# EAGLE design KD Board (EAGLE 9.0.0)
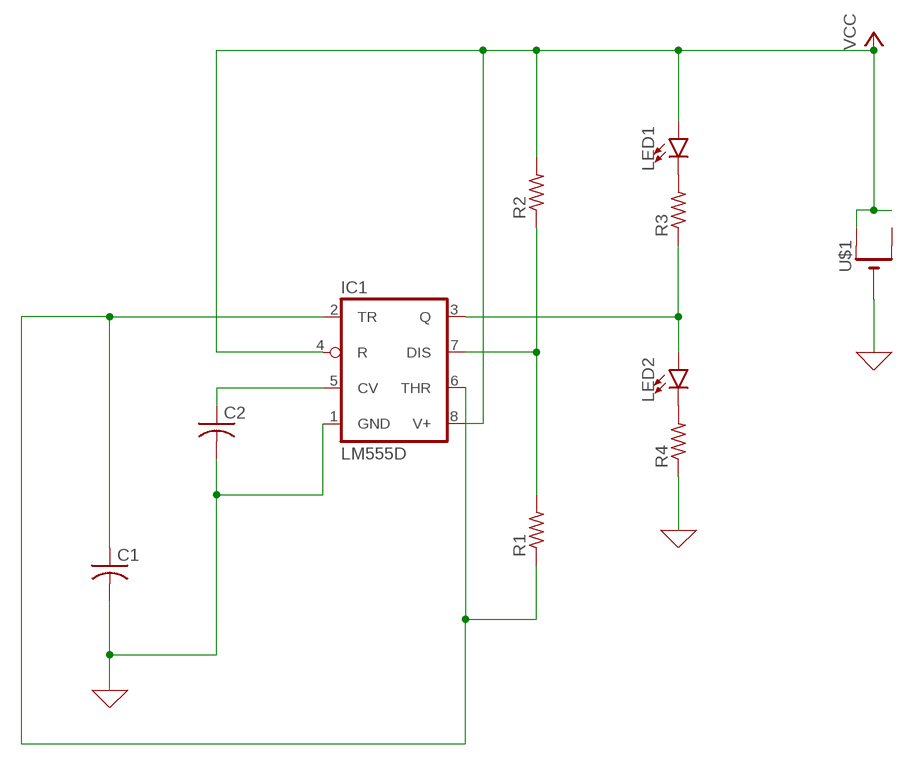
[diagram p0: schematic, sheet 1]

## Parts
C1  C-USC0805K  [C0805K]
C2  C-USC0805K  [C0805K]
IC1  LM555D  [SO08]
LED1  LED  [LED_5MM]
LED2  LED  [LED_5MM]
R1  R-US_M0805  [M0805]
R2  R-US_M0805  [M0805]
R3  R-US_M0805  [M0805]
R4  R-US_M0805  [M0805]
U$1  CR1220THM  [CR1220-THM]

## Nets
0: C1.2 C2.2 IC1.1(GND) R4.1 U$1.- ; supply symbol labelled GND
N$1: C2.1 IC1.5(CV)
N$2: C1.1 IC1.2(TR) IC1.6(THR) R1.1
N$4: IC1.7(DIS) R1.2 R2.1
N$6: LED1.K(C) R3.2
N$7: LED2.K(C) R4.2
N$8: IC1.3(Q) LED2.A R3.1
VCC: IC1.4(R) IC1.8(V+) LED1.A R2.2 U$1.+1(+)
Unconnected: U$1.+2(+1)

## Library data of the parts
C1 C2 = resistor:C-US: CAPACITOR, American symbol
IC1 = linear:*555: TIMER
LED1 LED2 = League_555_Blinky:LED
R1-R4 = resistor:R-US_: RESISTOR, American symbol
U$1 = League_555_Blinky:CR1220: CR1216/CR1220/CR1225 12mm 3V lithium coin cell Great for battery packup. Both SMT and THM holders. Note the THM package has the ground pads on both sides of the PCB so that the masks are the same - this reduces the cost

## Board
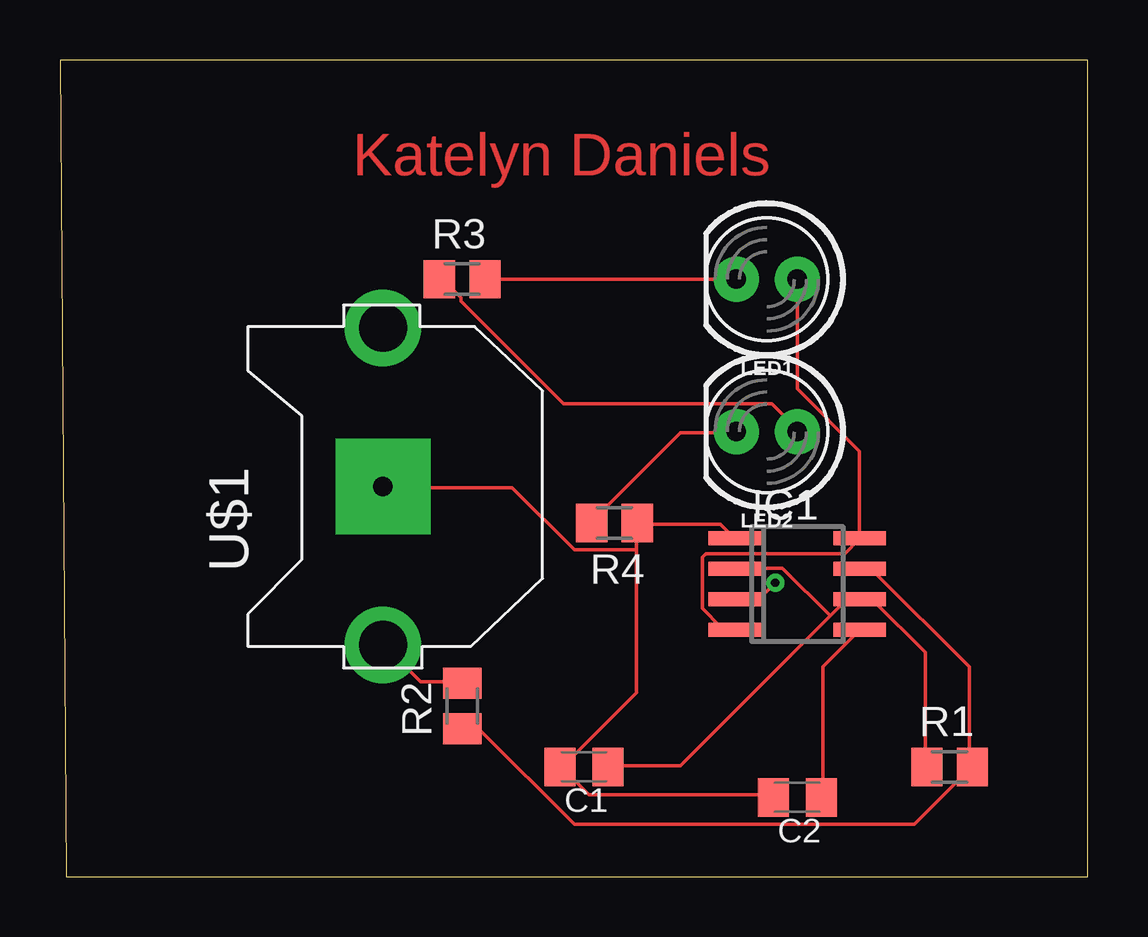
[diagram p1: board, top side]
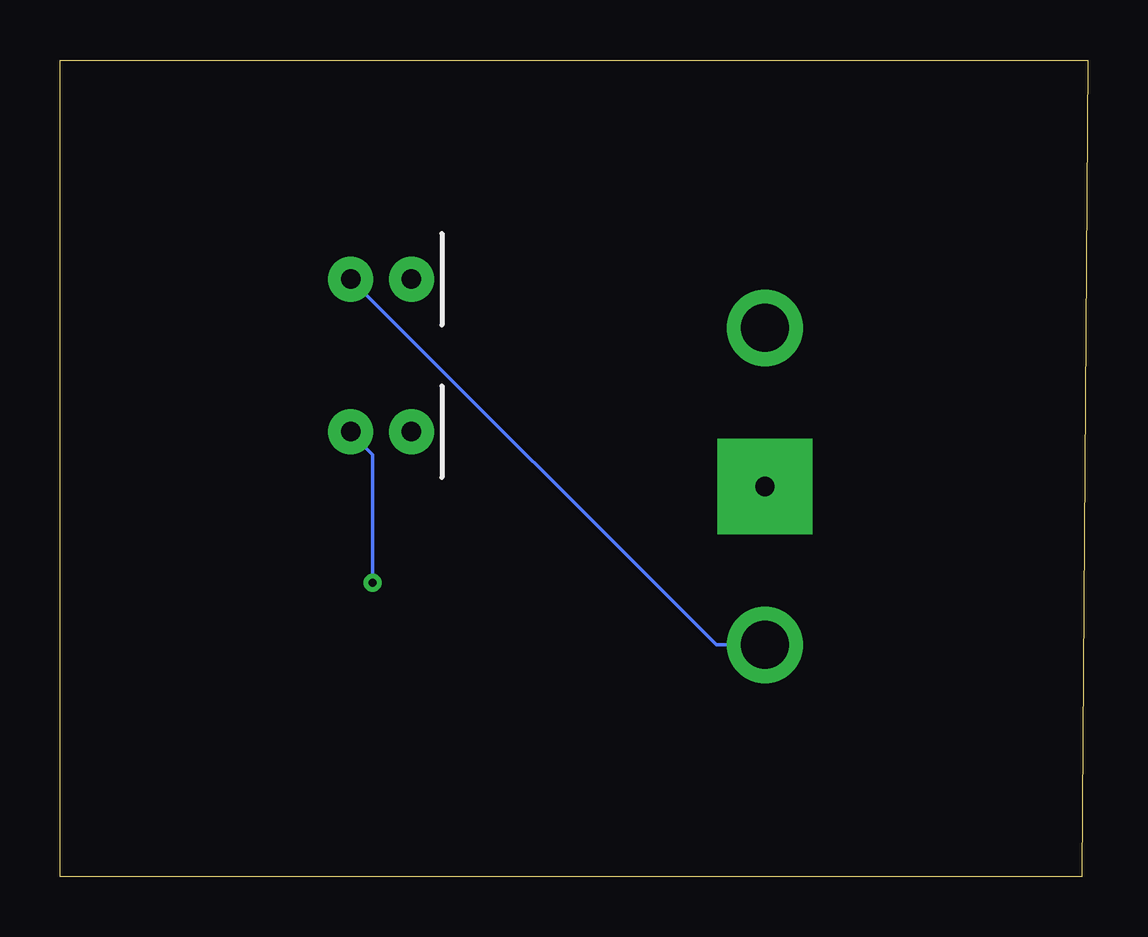
[diagram p2: board, bottom side, seen from below]

Size 42.85 x 34.03 mm. Coordinates in mm from the lower left corner, seen from the top.
Outline: 0.25,0 42.85,0 42.85,34.03 0,34.03 0.25,0
Copper layers (1*16): Top 0.035mm / dielectric 1.5mm / Bottom 0.035mm
Design rules "default": minimum track width 6mil, minimum drill 0.35mm, track to track 6mil, track to pad 6mil, pad to pad 6mil, via to via 6mil, smd to smd 6mil, copper to edge 40mil, drill to drill 6mil, minimum pad ring 10mil, minimum via ring 8mil, stop-mask expansion 4mil, vias tented up to drill 0mil, thermal gap 10mil

### Footprints (pad centres in the part's own frame; a part is rotated, then mirrored left to right if it is on the bottom)
C0805K = smd 1.3 x 1.6: 1 -1,0; 2 1,0
SO08 = smd 0.6 x 2.2: 1 -1.905,-2.6; 2 -0.635,-2.6; 3 0.635,-2.6; 4 1.905,-2.6; 5 1.905,2.6; 6 0.635,2.6; 7 -0.635,2.6; 8 -1.905,2.6
LED_5MM = drill 0.813 pad 1.88: A -1.27,0; K 1.27,0
M0805 = smd 1.3 x 1.6: 1 -0.95,0; 2 0.95,0
CR1220-THM = drill 2 pad 3.175: +1 -6.604,0; +2 6.604,0 | drill 0.8 pad 3.962 square: - 0,0

### Placement (x,y rotation side)
C1  21.84,4.57 180 top
C2  30.73,3.3 180 top
IC1  30.73,12.19 270 top
LED1  29.46,24.89 180 top
LED2  29.46,18.54 180 top
R1  37.08,4.57 0 top
R2  16.76,7.11 90 top
R3  16.76,24.89 0 top
R4  23.11,14.73 180 top
U$1  13.46,16.26 90 top

### Tracks (layer width: path | path; a pad name or v marks a point on that pad's centre or on a via)
0
  Top 0.152: IC1.1 27.99,14.22 27.53,14.68 24.18,14.68 R4.1 24.03,14.68 24.03,13.61 | C2.2 29.67,3.4 22.05,3.4 20.98,4.47 C1.2 20.98,4.62 24.03,7.67 24.03,13.61 | 24.03,13.61 21.44,13.61 18.85,16.2 13.51,16.2 U$1.-
N$1
  Top 0.152: C2.1 31.8,3.4 31.8,8.74 33.32,10.26 IC1.5
N$2
  Top 0.152: 32.11,10.87 32.71,11.48 33.32,11.48 IC1.6 33.48,11.48 33.93,11.48 36.07,9.35 36.07,4.62 R1.1 | 32.11,10.87 25.86,4.62 22.96,4.62 C1.1 | 32.11,10.87 30.12,12.85 28.14,12.85 IC1.2
N$4
  Top 0.152: IC1.7 33.48,12.7 33.93,12.7 37.9,8.74 37.9,4.62 R1.2 37.9,4.47 35.61,2.18 21.44,2.18 17.48,6.15 16.87,6.15 R2.1
N$6
  Top 0.152: LED1.K R3.2
N$7
  Top 0.152: R4.2 22.2,14.83 25.86,18.49 28.14,18.49 LED2.K
N$8  (via drill 0.35)
  Top 0.152: R3.1 15.95,24.89 16.71,24.13 16.71,23.98 20.98,19.71 29.67,19.71 30.73,18.64 LED2.A | v29.82,12.24 29.21,11.63 28.14,11.63 IC1.3
  Bottom 0.152: v29.82,12.24 29.82,17.58 30.73,18.49 LED2.A
VCC
  Top 0.152: R2.2 16.71,8.13 15.04,8.13 13.51,9.65 U$1.+1 | IC1.4 27.99,10.41 27.53,10.41 26.77,11.18 26.77,13.31 26.92,13.46 32.71,13.46 33.32,14.07 IC1.8 33.32,14.22 33.32,17.73 30.73,20.32 LED1.A
  Bottom 0.152: U$1.+1 15.49,9.65 LED1.A

### Text on the board
Top: Katelyn Daniels